# EAGLE design MethaneFlux (EAGLE 9.6.2)
Assembly variants: v1.0

## Sheet 1 of 2: Board 1- Power Module, Arduino MRK NB 1500, Methane Sensors (2600 2602 2611)
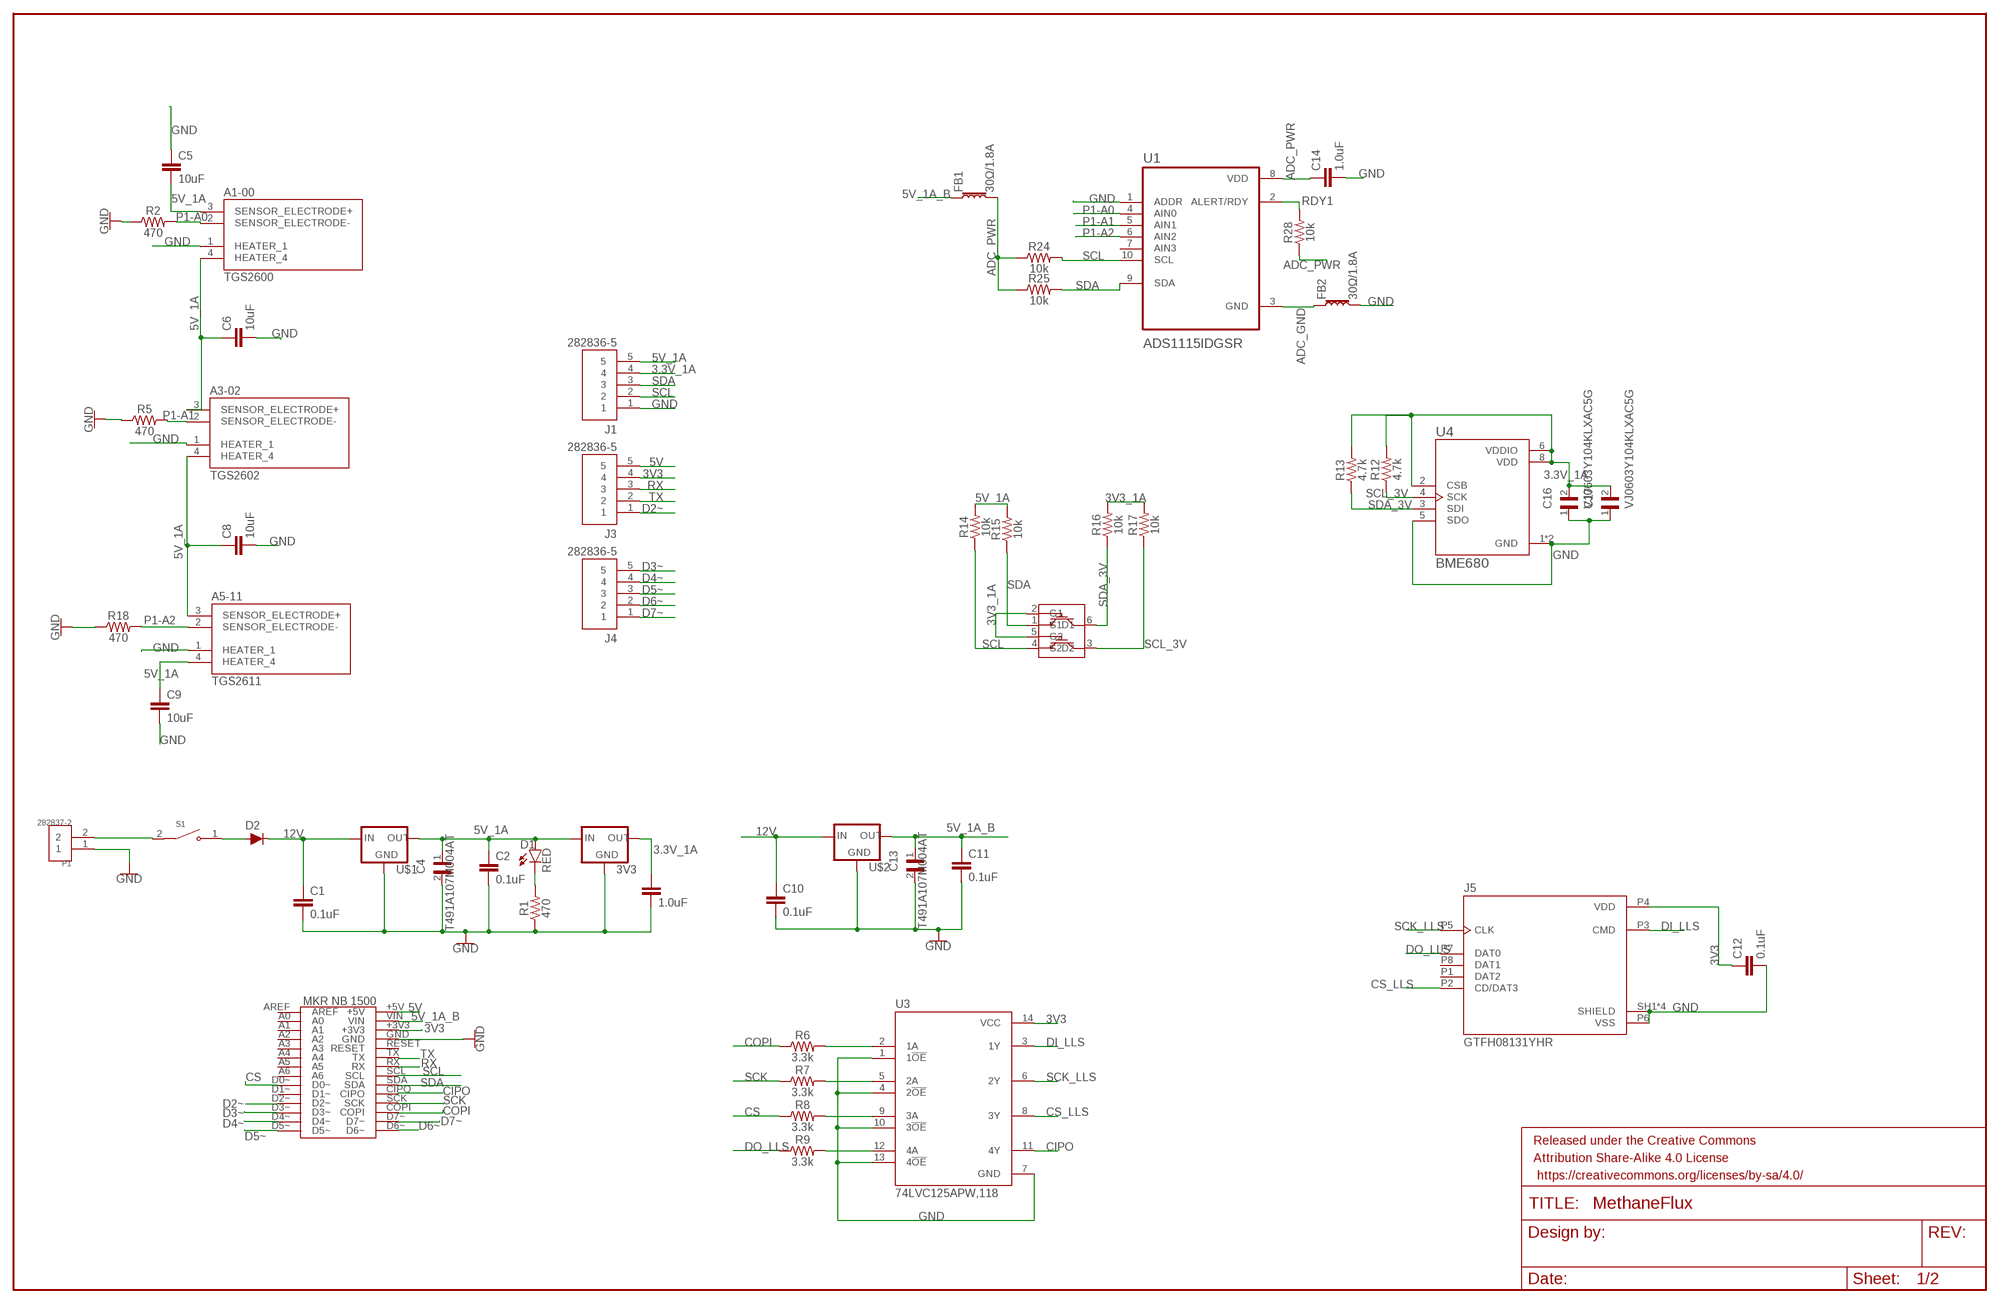
[diagram p0: schematic, sheet 1]

### Parts
3V3  V_REG_LD1117VXXLD1117-SMD  [SOT223]
A1-00  TGS2600  [TO255P920H830-4]
A3-02  TGS2602  [TGS2602]
A5-11  TGS2611  [TGS2611]
C1  0.1uF  0.1UF-0603-25V-5%  [0603]
C2  0.1uF  0.1UF-0603-25V-5%  [0603]
C3  1.0uF  1.0UF-0603-16V-10%  [0603]
C4  T491A107M004AT  [CAPC3216X110N]
C5  10uF  10UF-0603-6.3V-20%  [0603]
C6  10uF  10UF-0603-6.3V-20%  [0603]
C8  10uF  10UF-0603-6.3V-20%  [0603]
C9  10uF  10UF-0603-6.3V-20%  [0603]
C10  0.1uF  0.1UF-0603-25V-5%  [0603]
C11  0.1uF  0.1UF-0603-25V-5%  [0603]
C12  0.1uF  0.1UF-0603-25V-5%  [0603]
C13  T491A107M004AT  [CAPC3216X110N]
C14  1.0uF  1.0UF-0603-16V-10%  [0603]
C16  VJ0603Y104KLXAC5G  [CAPC1608X92N]
C17  VJ0603Y104KLXAC5G  [CAPC1608X92N]
D1  RED  LED-RED0603  [LED-0603]
D2  200mA/100V/1V  DIODE-1N4148  [DIODE-1N4148]
FB1  30Ω/1.8A  FERRITE_BEAD-0603  [0603]
FB2  30Ω/1.8A  FERRITE_BEAD-0603  [0603]
FRAME1  FRAME-LEDGER  [CREATIVE_COMMONS]
J1  282836-5  [TE_282836-5]
J3  282836-5  [TE_282836-5]
J4  282836-5  [TE_282836-5]
J5  GTFH08131YHR  [AMPHENOL_GTFH08131YHR]
P1  282837-2  [TE_282837-2]
R1  470  470OHM-0603-1/10W-1%  [0603]
R2  470  470OHM-0603-1/10W-1%  [0603]
R5  470  470OHM-0603-1/10W-1%  [0603]
R6  3.3k  3.3KOHM-0603-1/10W-1%  [0603]
R7  3.3k  3.3KOHM-0603-1/10W-1%  [0603]
R8  3.3k  3.3KOHM-0603-1/10W-1%  [0603]
R9  3.3k  3.3KOHM-0603-1/10W-1%  [0603]
R12  4.7k  4.7KOHM-0603-1/10W-1%  [0603]
R13  4.7k  4.7KOHM-0603-1/10W-1%  [0603]
R14  10k  10KOHM-0603-1/10W-1%  [0603]
R15  10k  10KOHM-0603-1/10W-1%  [0603]
R16  10k  10KOHM-0603-1/10W-1%  [0603]
R17  10k  10KOHM-0603-1/10W-1%  [0603]
R18  470  470OHM-0603-1/10W-1%  [0603]
R24  10k  10KOHM-0603-1/10W-1%  [0603]
R25  10k  10KOHM-0603-1/10W-1%  [0603]
R28  10k  10KOHM-0603-1/10W-1%  [0603]
S1  RB141C1100  [SW_RB141C1100]
U1  ADS1115IDGSR  [SOP50P490X110-10N]
U3  74LVC125APW,118  [IC_74LVC125APW,118]
U4  BME680  [PSON80P300X300X100-8N]
U$1  V_REG_LD1117VXXLD1117-SMD  [SOT223]
U$2  V_REG_LD1117VXXLD1117-SMD  [SOT223]
U$3  2N7002DW  [SOT363]
U$5  MKRNB1500  [MRKNB1500]

### Nets
3.3V_1A [5$3v3_1A]: 3V3.2(OUT) C3.1 C16.2 C17.2 J1.4 R12.2 R13.2 U4.2(CSB) U4.6(VDDIO) U4.8(VDD)
3V3: C12.1 J3.4 J5.P4(VDD) U3.14(VCC) U$5.+3V3
3V3_1A: R16.2 R17.2 U$3.2(G1) U$3.5(G2)
5V: J3.5 U$5.+5V
5V_1A [5$3v3_1A]: 3V3.3(IN) A1-00.3(SENSOR_ELECTRODE+) A1-00.4(HEATER_4) A3-02.3(SENSOR_ELECTRODE+) A3-02.4(HEATER_4) A5-11.3(SENSOR_ELECTRODE+) A5-11.4(HEATER_4) C2.1 C4.1 C5.2 C6.1 C8.1 C9.1 D1.A J1.5 R14.2 R15.2 U$1.2(OUT)
5V_1A_B [5$3v3_1A]: C11.1 C13.1 FB1.1 U$2.2(OUT) U$5.VIN
12V [PowerIn]: C1.1 C10.1 D2.C U$1.3(IN) U$2.3(IN)
ADC_GND: FB2.1 U1.3(GND)
ADC_PWR: C14.1 FB1.2 R24.1 R25.1 R28.1 U1.8(VDD)
CIPO: U3.11(4Y) U$5.CIPO
COPI: R6.1 U$5.COPI
CS: R8.1 U$5.D0~
CS_LLS: J5.P2(CD/DAT3) U3.8(3Y)
D2~: J3.1 U$5.D2~
D3~: J4.5 U$5.D3~
D4~: J4.4 U$5.D4~
D5~: J4.3 U$5.D5~
D6~: J4.2 U$5.D6~
D7~: J4.1 U$5.D7~
DI_LLS: J5.P3(CMD) U3.3(1Y)
DO_LLS: J5.P7(DAT0) R9.1
GND [GND]: 3V3.1(GND) A1-00.1(HEATER_1) A3-02.1(HEATER_1) A5-11.1(HEATER_1) C1.2 C2.2 C3.2 C4.2 C5.1 C6.2 C8.2 C9.2 C10.2 C11.2 C12.2 C13.2 C14.2 C16.1 C17.1 FB2.2 J1.1 J5.P6(VSS) J5.SH1(SHIELD) J5.SH2(SHIELD) J5.SH3(SHIELD) J5.SH4(SHIELD) P1.1 R1.1 R2.1 R5.1 R18.1 U1.1(ADDR) U3.1(1!OE) U3.4(2!OE) U3.7(GND) U3.10(3!OE) U3.13(4!OE) U4.1(GND) U4.5(SDO) U4.7(GND) U$1.1(GND) U$2.1(GND) U$5.GND
N$1: R6.2 U3.2(1A)
N$2 [5$3v3_1A]: D1.C R1.2
N$3: R7.2 U3.5(2A)
N$4 [PowerIn]: P1.2 S1.2
N$5: D2.A S1.1
N$6: R8.2 U3.9(3A)
N$7: R9.2 U3.12(4A)
P1-A0 [ADC]: A1-00.2(SENSOR_ELECTRODE-) R2.2 U1.4(AIN0)
P1-A1 [ADC]: A3-02.2(SENSOR_ELECTRODE-) R5.2 U1.5(AIN1)
P1-A2 [ADC]: A5-11.2(SENSOR_ELECTRODE-) R18.2 U1.6(AIN2)
RDY1: R28.2 U1.2(ALERT/RDY)
RX: J3.3 U$5.RX
SCK: R7.1 U$5.SCK
SCK_LLS: J5.P5(CLK) U3.6(2Y)
SCL: J1.2 R14.1 R24.2 U1.10(SCL) U$3.4(S2) U$5.SCL
SCL_3V: R12.1 R17.1 U4.4(SCK) U$3.3(D2)
SDA: J1.3 R15.1 R25.2 U1.9(SDA) U$3.1(S1) U$5.SDA
SDA_3V: R13.1 R16.1 U4.3(SDI) U$3.6(D1)
TX: J3.2 U$5.TX
Unconnected: J5.P1(DAT2) J5.P8(DAT1) U1.7(AIN3) U$5.A0 U$5.A1 U$5.A2 U$5.A3 U$5.A4 U$5.A5 U$5.A6 U$5.AREF U$5.D1~ U$5.RESET

## Sheet 2 of 2: Breakoff part to board 1- Methane Sensors (2600 2602 2611) and the ADC & BME
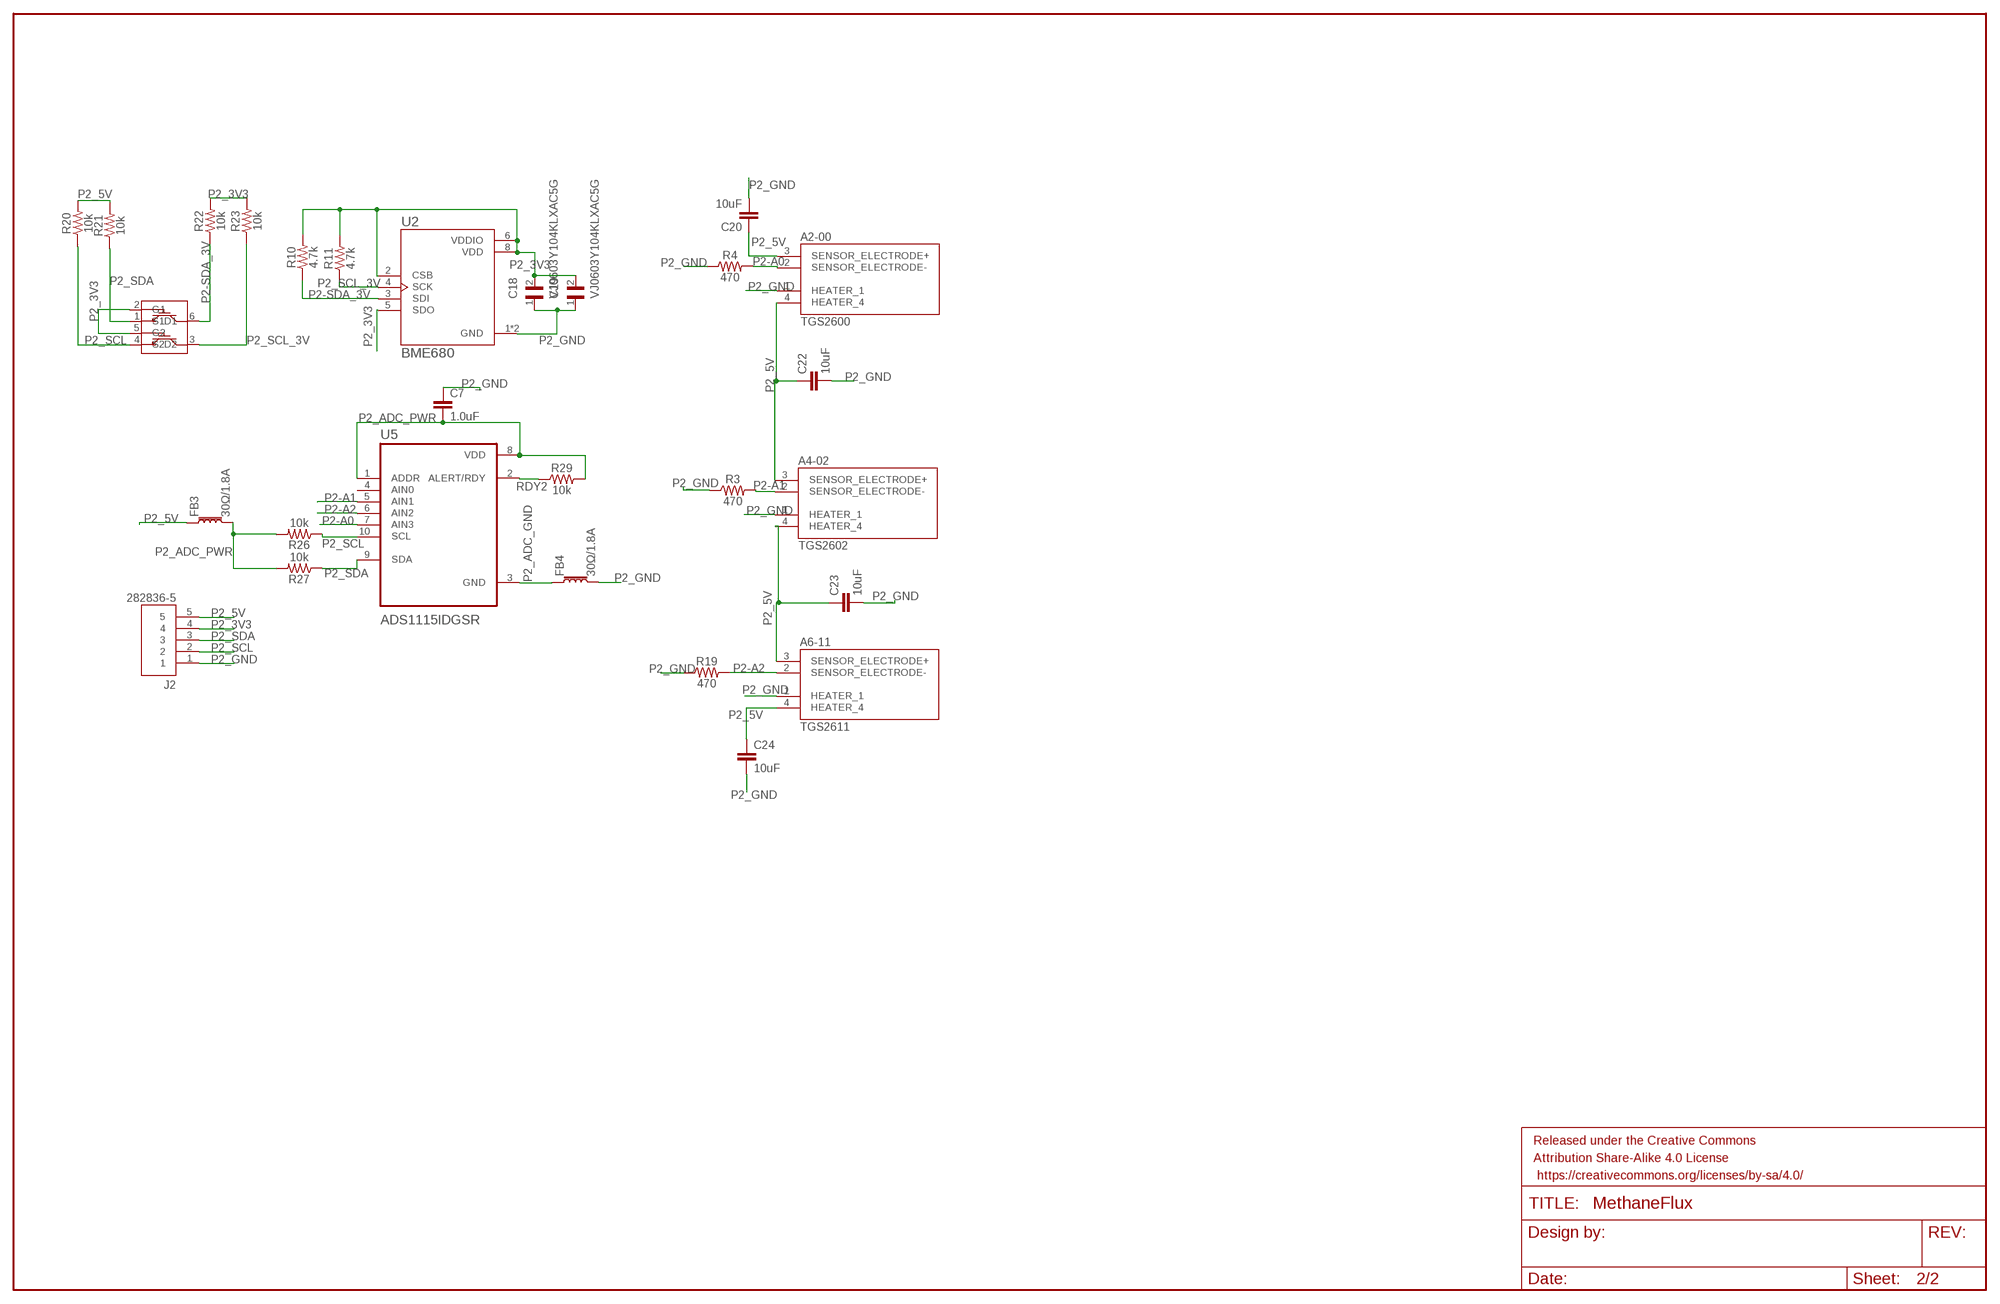
[diagram p1: schematic, sheet 2]

### Parts
A2-00  TGS2600  [TO255P920H830-4]
A4-02  TGS2602  [TGS2602]
A6-11  TGS2611  [TGS2611]
C7  1.0uF  1.0UF-0603-16V-10%  [0603]
C18  VJ0603Y104KLXAC5G  [CAPC1608X92N]
C19  VJ0603Y104KLXAC5G  [CAPC1608X92N]
C20  10uF  10UF-0603-6.3V-20%  [0603]
C22  10uF  10UF-0603-6.3V-20%  [0603]
C23  10uF  10UF-0603-6.3V-20%  [0603]
C24  10uF  10UF-0603-6.3V-20%  [0603]
FB3  30Ω/1.8A  FERRITE_BEAD-0603  [0603]
FB4  30Ω/1.8A  FERRITE_BEAD-0603  [0603]
FRAME2  FRAME-LEDGER  [CREATIVE_COMMONS]
J2  282836-5  [TE_282836-5]
R3  470  470OHM-0603-1/10W-1%  [0603]
R4  470  470OHM-0603-1/10W-1%  [0603]
R10  4.7k  4.7KOHM-0603-1/10W-1%  [0603]
R11  4.7k  4.7KOHM-0603-1/10W-1%  [0603]
R19  470  470OHM-0603-1/10W-1%  [0603]
R20  10k  10KOHM-0603-1/10W-1%  [0603]
R21  10k  10KOHM-0603-1/10W-1%  [0603]
R22  10k  10KOHM-0603-1/10W-1%  [0603]
R23  10k  10KOHM-0603-1/10W-1%  [0603]
R26  10k  10KOHM-0603-1/10W-1%  [0603]
R27  10k  10KOHM-0603-1/10W-1%  [0603]
R29  10k  10KOHM-0603-1/10W-1%  [0603]
U2  BME680  [PSON80P300X300X100-8N]
U5  ADS1115IDGSR  [SOP50P490X110-10N]
U$4  2N7002DW  [SOT363]

### Nets
P2-A0 [ADC]: A2-00.2(SENSOR_ELECTRODE-) R4.2 U5.7(AIN3)
P2-A1 [ADC]: A4-02.2(SENSOR_ELECTRODE-) R3.2 U5.5(AIN1)
P2-A2 [ADC]: A6-11.2(SENSOR_ELECTRODE-) R19.2 U5.6(AIN2)
P2-SDA_3V: R10.1 R22.1 U2.3(SDI) U$4.6(D1)
P2_3V3 [5$3v3_1A]: C18.2 C19.2 J2.4 R10.2 R11.2 R22.2 R23.2 U2.2(CSB) U2.5(SDO) U2.6(VDDIO) U2.8(VDD) U$4.2(G1) U$4.5(G2)
P2_5V [5$3v3_1A]: A2-00.3(SENSOR_ELECTRODE+) A2-00.4(HEATER_4) A4-02.3(SENSOR_ELECTRODE+) A4-02.4(HEATER_4) A6-11.3(SENSOR_ELECTRODE+) A6-11.4(HEATER_4) C20.1 C22.1 C23.1 C24.1 FB3.1 J2.5 R20.2 R21.2
P2_ADC_GND: FB4.1 U5.3(GND)
P2_ADC_PWR: C7.2 FB3.2 R26.2 R27.2 R29.2 U5.1(ADDR) U5.8(VDD)
P2_GND [P2_GND]: A2-00.1(HEATER_1) A4-02.1(HEATER_1) A6-11.1(HEATER_1) C7.1 C18.1 C19.1 C20.2 C22.2 C23.2 C24.2 FB4.2 J2.1 R3.1 R4.1 R19.1 U2.1(GND) U2.7(GND)
P2_SCL: J2.2 R20.1 R26.1 U5.10(SCL) U$4.4(S2)
P2_SCL_3V: R11.1 R23.1 U2.4(SCK) U$4.3(D2)
P2_SDA: J2.3 R21.1 R27.1 U5.9(SDA) U$4.1(S1)
RDY2: R29.1 U5.2(ALERT/RDY)
Unconnected: U5.4(AIN0)

## Library data of the parts
3V3 U$1 U$2 = SparkFun-IC-Power:V_REG_LD1117VXX: LD1117VXX voltage regulator. We carry the 3.3V version (COM-00526) in TO-220 package.; PROD_ID: VREG-13917
A1-00 A2-00 = TGS2600:TGS2600: Check availability <https://pricing.snapeda.com/parts/TGS2600/Figaro/view-part?ref=eda>; AVAILABILITY: In Stock; CHECK_PRICES: https://www.snapeda.com/parts/TGS2600/Figaro/view-part/?ref=eda; DESCRIPTION: Gas sensor [Figaro] TGS2600 Gas sensor; MF: Figaro; MP: TGS2600; PACKAGE: None; PRICE: None; SNAPEDA_LINK: https://www.snapeda.com/parts/TGS2600/Figaro/view-part/?ref=snap
A3-02 A4-02 = TGS2600:TGS2602
A5-11 A6-11 = TGS2600:TGS2611
C1 C2 C10-C12 = SparkFun-Capacitors:0.1UF: 0.1µF ceramic capacitors A capacitor is a passive two-terminal electrical component used to store electrical energy temporarily in an electric field.; PROD_ID: CAP-08604
C3 C7 C14 = SparkFun-Capacitors:1.0UF: 1µF ceramic capacitors A capacitor is a passive two-terminal electrical component used to store electrical energy temporarily in an electric field.; PROD_ID: CAP-00868
C4 C13 = T491A107M004AT:T491A107M004AT: Tantalum Capacitor; Capacitor Type:Solid; Capacitance:100µF; Capacitance Tolerance:± 20%; Voltage Rating:4VDC; Capacitor Dielectric Type:Tantalum; Package/Case:3216-18; Termination Type:SMD; ESR:4ohm; Leaded Process Compatible:Yes ;RoHS Compliant: Yes Check availability <https://pricing.snapeda.com/parts/T491A107M004AT/KEMET/view-part?ref=eda>; AVAILABILITY: In Stock; CHECK_PRICES: https://www.snapeda.com/parts/T491A107M004AT/KEMET/view-part/?ref=eda; DESCRIPTION: Capacitors Tantalum PCB 100uF SMD Tol 20% 4 VDC Case Size 3216 T491 Series | KEMET T491A107M004AT; MF: KEMET; MP: T491A107M004AT; PACKAGE: SMD-2 KEMET; PRICE: None; PURCHASE-URL: https://www.snapeda.com/api/url_track_click_mouser/?unipart_id=577514&manufacturer=KEMET&part_name=T491A107M004AT&search_term=t491a107m004at; SNAPEDA_LINK: https://www.snapeda.com/parts/T491A107M004AT/KEMET/view-part/?ref=snap
C5 C6 C8 C9 C20 C22-C24 = SparkFun-Capacitors:10UF: 10.0µF ceramic capacitors A capacitor is a passive two-terminal electrical component used to store electrical energy temporarily in an electric field.; PROD_ID: CAP-11015
C16-C19 = VJ0603Y104KLXAC5G:VJ0603Y104KLXAC5G: Multilayer Ceramic Capacitors MLCC - SMD/SMT 100nF 25volts 10% Check availability <https://pricing.snapeda.com/parts/VJ0603Y104KLXAC5G/Vishay/view-part?ref=eda>; AVAILABILITY: In Stock; CHECK_PRICES: https://www.snapeda.com/parts/VJ0603Y104KLXAC5G/Vishay/view-part/?ref=eda; DESCRIPTION: Multilayer Ceramic Capacitors MLCC - SMD/SMT 100nF 25volts 10%; MF: Vishay; MP: VJ0603Y104KLXAC5G; PACKAGE: 0603 Vishay; PRICE: None; SNAPEDA_LINK: https://www.snapeda.com/parts/VJ0603Y104KLXAC5G/Vishay/view-part/?ref=snap
D1 = SparkFun-LED:LED-RED: Red SMD LED Used in manufacturing of most products at SparkFun Packages: 0603 - SMD 0603 package [Product Link] <http://docs.avagotech.com/docs/AV02-0551EN> 0603 SMART - SMD 0603 SMART package ( more efficient and expensive)[Product Link] <http://www.osram-os.com/Graphics/XPic2/00077099_0.pdf> 1206 - SMD1206 package [Product Link] <https://www.sparkfun.com/datasheets/DevTools/LilyPad/Q150OVS4.pdff> SparkFun Products: Pro Mini 328 -5V <https://www.sparkfun.com/products/821> RedBoard <https://www.sparkfun.com/products/12757> IOIO-OTG <https://www.sparkfun.com/products/13613>; PROD_ID: DIO-00819
D2 = SparkFun-DiscreteSemi:DIODE: Diode These are standard reverse protection diodes and small signal diodes. SparkFun Products: SparkFun SparkPunk Sound Kit <https://www.sparkfun.com/products/11177> SparkFun ESP8266 Thing <https://www.sparkfun.com/products/13231>; PROD_ID: DIO-08378
FB1-FB4 = SparkFun-Coils:FERRITE_BEAD: Ferrite Bead (blocks, cores, rings, chokes, etc.) Inductor with layers of ferrite used to suppress high frequencies. Often used to isolate high frequency noise. SparkFun Products: IOIO-OTG - V2.2 <https://www.sparkfun.com/products/13613> SparkFun SAMD21 Mini Breakout <https://www.sparkfun.com/products/13664> SparkFun 6 Degrees of Freedom Breakout - LSM6DS3 <https://www.sparkfun.com/products/13339> SparkFun SAMD21 Dev Breakout <https://www.sparkfun.com/products/13672>; PROD_ID: NDUC-13805
FRAME1 FRAME2 = SparkFun-Aesthetics:FRAME-LEDGER: Schematic Frame - Ledger Standard 11x14 US Ledger frame
J1-J4 = 282836-5:282836-5: Check availability <https://pricing.snapeda.com/parts/282836-5/TE%20Connectivity/view-part?ref=eda>; AVAILABILITY: In Stock; CHECK_PRICES: https://www.snapeda.com/parts/282836-5/TE+Connectivity+AMP+Connectors/view-part/?ref=eda; COMMENT: 282836-5; DESCRIPTION: 5 Position Wire to Board Terminal Block Horizontal with Board 0.197 (5.00mm) Through Hole; EU_ROHS_COMPLIANCE: Compliant with Exemptions; MF: TE Connectivity; MP: 282836-5; PACKAGE: None; PRICE: None; PURCHASE-URL: https://www.snapeda.com/api/url_track_click_mouser/?unipart_id=417471&manufacturer=TE Connectivity&part_name=282836-5&search_term=282836-5; SNAPEDA_LINK: https://www.snapeda.com/parts/282836-5/TE+Connectivity+AMP+Connectors/view-part/?ref=snap
J5 = GTFH08131YHR:GTFH08131YHR: Check availability <https://pricing.snapeda.com/parts/GTFH08131YHR/Amphenol%20ICC/view-part?ref=eda>; AVAILABILITY: In Stock; CHECK_PRICES: https://www.snapeda.com/parts/GTFH08131YHR/Amphenol+FCI/view-part/?ref=eda; DESCRIPTION: Micro SD and SD Card Sockets, Input Output Connectors, Micro SD Socket, 8 Position, Hinge Type Right Angle SMT, LCP Black; MF: Amphenol ICC; MP: GTFH08131YHR; PACKAGE: None; PRICE: None; PURCHASE-URL: https://www.snapeda.com/api/url_track_click_mouser/?unipart_id=3603870&manufacturer=Amphenol ICC&part_name=GTFH08131YHR&search_term=micro sd socket; SNAPEDA_LINK: https://www.snapeda.com/parts/GTFH08131YHR/Amphenol+FCI/view-part/?ref=snap
P1 = 282837-2:282837-2: TERM BLOCK 5.08MM 2POS SIDE ENTY Check availability <https://pricing.snapeda.com/parts/282837-2/TE%20Connectivity/view-part?ref=eda>; AVAILABILITY: In Stock; CHECK_PRICES: https://www.snapeda.com/parts/282837-2/TE+Connectivity+AMP+Connectors/view-part/?ref=eda; COMMENT: 282837-2; DESCRIPTION: Terminal Block Connector Wire Receptacle 2 5.08 mm 30-16 AWG Green 13.5 A 250 V | TE Connectivity 282837-2; MF: TE Connectivity; MP: 282837-2; PACKAGE: None; PRICE: None; PURCHASE-URL: https://www.snapeda.com/api/url_track_click_mouser/?unipart_id=2549980&manufacturer=TE Connectivity&part_name=282837-2&search_term=None; SNAPEDA_LINK: https://www.snapeda.com/parts/282837-2/TE+Connectivity+AMP+Connectors/view-part/?ref=snap
R1-R5 R18 R19 = SparkFun-Resistors:470OHM: 470Ω resistor A resistor is a passive two-terminal electrical component that implements electrical resistance as a circuit element. Resistors act to reduce current flow, and, at the same time, act to lower voltage levels within circuits. - Wikipedia; PROD_ID: RES-07869
R6-R9 = SparkFun-Resistors:3.3KOHM: 3.3kΩ resistor A resistor is a passive two-terminal electrical component that implements electrical resistance as a circuit element. Resistors act to reduce current flow, and, at the same time, act to lower voltage levels within circuits. - Wikipedia; PROD_ID: RES-07851
R10-R13 = SparkFun-Resistors:4.7KOHM: 4.7kΩ resistor A resistor is a passive two-terminal electrical component that implements electrical resistance as a circuit element. Resistors act to reduce current flow, and, at the same time, act to lower voltage levels within circuits. - Wikipedia; PROD_ID: RES-07857
R14-R17 R20-R29 = SparkFun-Resistors:10KOHM: 10kΩ resistor A resistor is a passive two-terminal electrical component that implements electrical resistance as a circuit element. Resistors act to reduce current flow, and, at the same time, act to lower voltage levels within circuits. - Wikipedia; PROD_ID: RES-00824
S1 = RB141C1100:RB141C1100: Swicth SPST RB141C1100 Check availability <https://pricing.snapeda.com/parts/RB141C1100/E-Switch/view-part?ref=eda>; AVAILABILITY: In Stock; CHECK_PRICES: https://www.snapeda.com/parts/RB141C1100/E-Switch/view-part/?ref=eda; DESCRIPTION: Rocker Switch, RB1 Series, SPST, ON-OFF, Non-Illum, Black, 15A, 125VAC, QC | E-Switch RB141C1100; MF: E-Switch; MP: RB141C1100; PACKAGE: None; PRICE: None; PURCHASE-URL: https://www.snapeda.com/api/url_track_click_mouser/?unipart_id=4449618&manufacturer=E-Switch&part_name=RB141C1100&search_term=rs-001g-a-bb-4; SNAPEDA_LINK: https://www.snapeda.com/parts/RB141C1100/E-Switch/view-part/?ref=snap
U1 U5 = ADS1115IDGSR:ADS1115IDGSR: Check availability <https://pricing.snapeda.com/parts/ADS1115IDGSR/Texas%20Instruments/view-part?ref=eda>; AVAILABILITY: In Stock; CHECK_PRICES: https://www.snapeda.com/parts/ADS1115IDGSR/Texas+Instruments/view-part/?ref=eda; DESCRIPTION: 16-bit, 860-SPS, 4-channel, delta-sigma ADC with PGA, oscillator, VREF, comparator and I2C; MF: Texas Instruments; MP: ADS1115IDGSR; PACKAGE: VSSOP-10 Texas Instruments; PRICE: None; PURCHASE-URL: https://www.snapeda.com/api/url_track_click_mouser/?unipart_id=45903&manufacturer=Texas Instruments&part_name=ADS1115IDGSR&search_term=ads1115idgsr; SNAPEDA_LINK: https://www.snapeda.com/parts/ADS1115IDGSR/Texas+Instruments/view-part/?ref=snap
U2 U4 = BME680:BME680: Integrated Environmental Unit Check availability <https://pricing.snapeda.com/parts/BME680/Bosch%20Sensortec/view-part?ref=eda>; AVAILABILITY: In Stock; CHECK_PRICES: https://www.snapeda.com/parts/BME680/Bosch+Sensortec/view-part/?ref=eda; DESCRIPTION: Gas, Humidity, Pressure, Temperature Sensor I²C, SPI Output; MF: Bosch Sensortec; MP: BME680; PACKAGE: LGA-8 Bosch Tools; PRICE: None; PURCHASE-URL: https://www.snapeda.com/api/url_track_click_mouser/?unipart_id=947201&manufacturer=Bosch Sensortec&part_name=BME680&search_term=bme680; SNAPEDA_LINK: https://www.snapeda.com/parts/BME680/Bosch+Sensortec/view-part/?ref=snap
U3 = 74LVC125APW_118:74LVC125APW,118: Check availability <https://pricing.snapeda.com/parts/74LVC125APW%2C118/Nexperia%20USA%20Inc./view-part?ref=eda> Check availability <https://pricing.snapeda.com/parts/74LVC125APW%2C118/Nexperia%20USA%20Inc./view-part?ref=eda> Check availability <https://pricing.snapeda.com/parts/74LVC125APW%2C118/Nexperia%20USA%20Inc./view-part?ref=eda>; AVAILABILITY: In Stock; CHECK_PRICES: https://www.snapeda.com/parts/74LVC125APW,118/Nexperia/view-part/?ref=eda; DESCRIPTION: Buffer, Non-Inverting 4 Element 1 Bit per Element 3-State Output 14-TSSOP; MF: Nexperia USA Inc.; MP: 74LVC125APW,118; PACKAGE: TSSOP14-14 Nexperia USA Inc.; PRICE: None; PURCHASE-URL: https://www.snapeda.com/api/url_track_click_mouser/?unipart_id=5248541&manufacturer=Nexperia USA Inc.&part_name=74LVC125APW,118&search_term=74lvc125apw; SNAPEDA_LINK: https://www.snapeda.com/parts/74LVC125APW,118/Nexperia/view-part/?ref=snap
U$3 U$4 = 2N7002DW:2N7002DW: Check availability <https://pricing.snapeda.com/parts/2N7002DW/onsemi/view-part?ref=eda>; AVAILABILITY: In Stock; CHECK_PRICES: https://www.snapeda.com/parts/2N7002DW/Onsemi/view-part/?ref=eda; DESCRIPTION: Mosfet Array 60V 115mA 200mW Surface Mount SC-88 (SC-70-6); MF: onsemi; MP: 2N7002DW; PACKAGE: SC-88-6 ON Semiconductor; PRICE: None; PURCHASE-URL: https://www.snapeda.com/api/url_track_click_mouser/?unipart_id=7265289&manufacturer=onsemi&part_name=2N7002DW&search_term=2n7002dw; SNAPEDA_LINK: https://www.snapeda.com/parts/2N7002DW/Onsemi/view-part/?ref=snap
U$5 = MKRNB1500:MKRNB1500: Double check before printing that this layout is right.

## Net classes
0 I2C: width 0.229 mm, clearance 0.003 mm
1 ADC: width 0.305 mm, clearance 0.1 mm
2 PowerIn: width 0.508 mm, clearance 0.003 mm
3 5$3v3_1A: width 0.076 mm, clearance 0.003 mm
5 GND: width 0.025 mm, clearance 0.003 mm
6 P2_GND: width 0.025 mm, clearance 0.003 mm

## Board
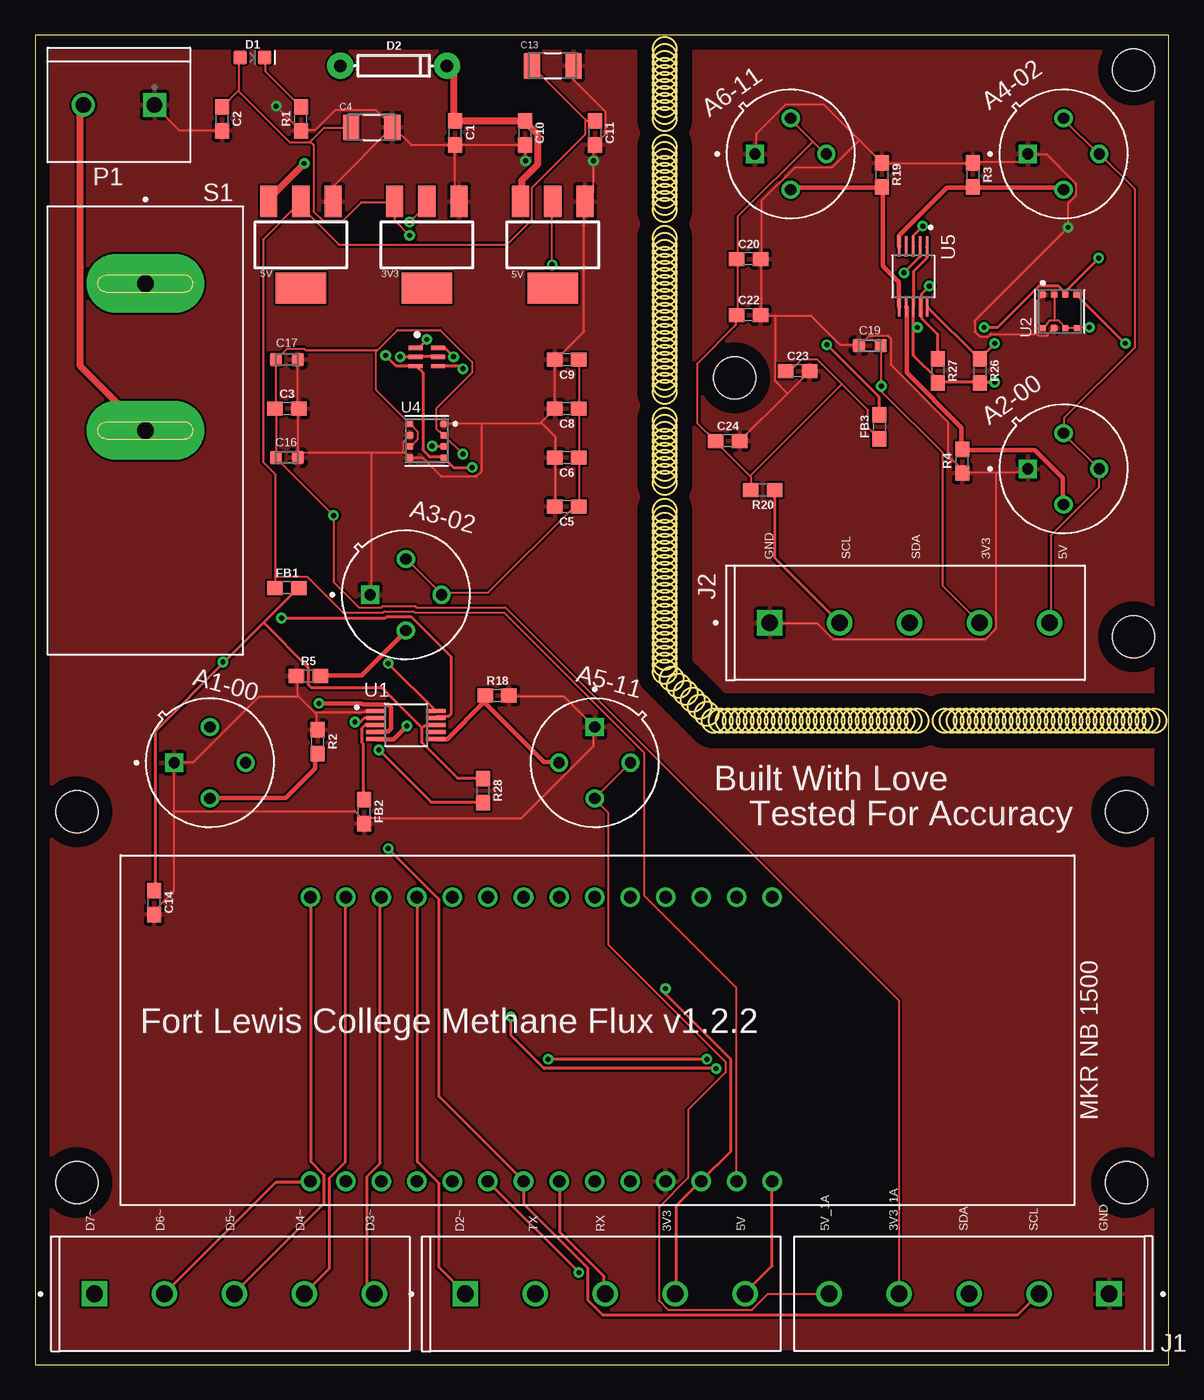
[diagram p2: board, top side]
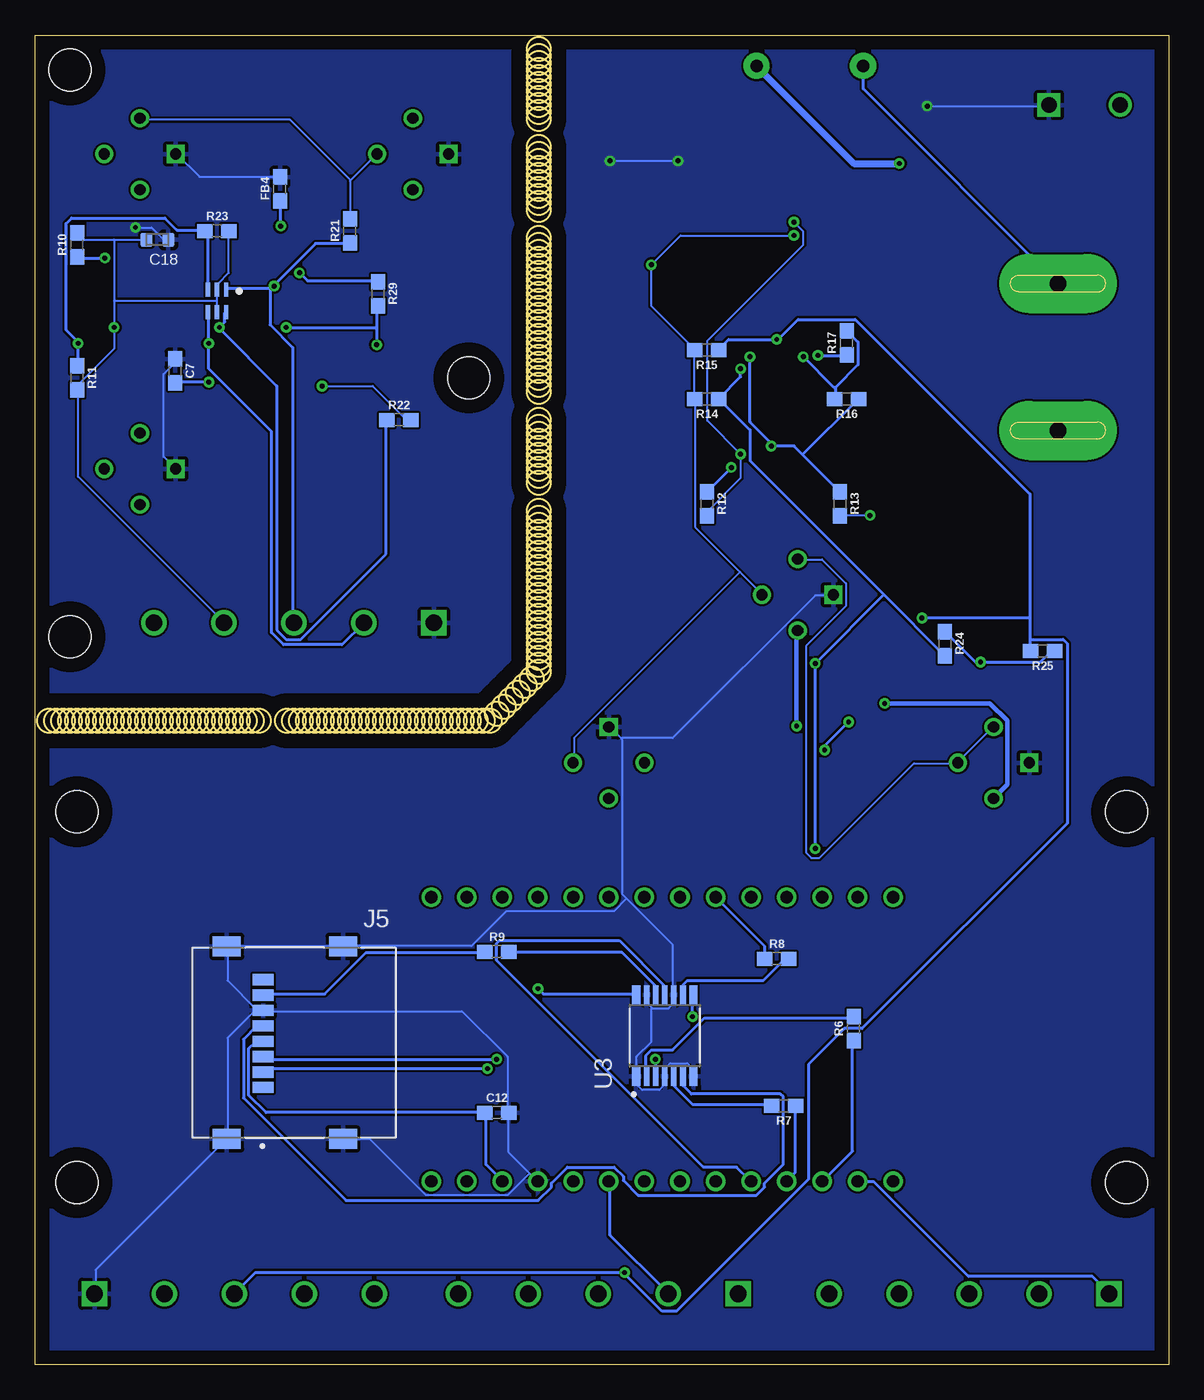
[diagram p3: board, bottom side, seen from below]

Size 81 x 95 mm. Coordinates in mm from the lower left corner, seen from the top.
Outline: 0,0 81,0 81,95 0,95 0,0
Outline: circle at 45,93.5 radius 0.85
Outline: circle at 45,93 radius 0.85
Outline: circle at 45,92.5 radius 0.85
Outline: circle at 45,92 radius 0.85
Outline: circle at 45,91.5 radius 0.85
Outline: circle at 45,91 radius 0.85
Outline: circle at 45,90.5 radius 0.85
Outline: circle at 45,90 radius 0.85
Outline: circle at 45,89.5 radius 0.85
Outline: circle at 45,87 radius 0.85
Outline: circle at 45,86.5 radius 0.85
Outline: circle at 45,86 radius 0.85
Outline: circle at 45,85.5 radius 0.85
Outline: circle at 45,85 radius 0.85
Outline: circle at 45,84.5 radius 0.85
Outline: circle at 45,84 radius 0.85
Outline: circle at 45,83.5 radius 0.85
Outline: circle at 45,83 radius 0.85
Outline: circle at 45,80.5 radius 0.85
Outline: circle at 45,80 radius 0.85
Copper layers (1*16): Top 0.035mm / dielectric 1.5mm / Bottom 0.035mm
Design rules "default *": minimum track width 6mil, minimum drill 0.35mm, track to track 6mil, track to pad 6mil, pad to pad 6mil, via to via 6mil, smd to smd 6mil, copper to edge 40mil, drill to drill 6mil, minimum pad ring 10mil, minimum via ring 8mil, stop-mask expansion 4mil, vias tented up to drill 0mil, thermal gap 10mil
Holes 3 mm at 78.5,52 50,70.5 78.5,92.5 78,39.5 78,13 3,13 3,39.5

### Footprints (pad centres in the part's own frame; a part is rotated, then mirrored left to right if it is on the bottom)
SOT223 = smd 1.219 x 2.235: 1 -2.311,-3.099; 2 0,-3.099; 3 2.311,-3.099 | smd 3.6 x 2.2: 4 0,3.099
TO255P920H830-4 = drill 0.8 square: 1 -2.55,0 | drill 0.8: 2 0,-2.55; 3 2.55,0; 4 0,2.55
TGS2602 = drill 0.8 square: 1 -2.55,0 | drill 0.8: 2 0,-2.55; 3 2.55,0; 4 0,2.55
TGS2611 = drill 0.8 square: 1 -2.55,0 | drill 0.8: 2 0,-2.55; 3 2.55,0; 4 0,2.55
0603 = smd 1.1 x 1: 1 -0.85,0; 2 0.85,0
CAPC3216X110N = smd 1.16 x 1.82: 1 -1.475,0; 2 1.475,0
CAPC1608X92N = smd 0.92 x 0.97: 1 -0.775,0; 2 0.775,0
LED-0603 = smd 1 x 1: A -0.877,0; C 0.877,0
DIODE-1N4148 = drill 0.9 pad 1.88: A -3.81,0; C 3.81,0
TE_282836-5 = drill 1.2 square: 1 -10,0 | drill 1.2: 2 -5,0; 3 0,0; 4 5,0; 5 10,0
AMPHENOL_GTFH08131YHR = smd 0.8 x 1.5: P1 3.2,-2.2; P2 2.1,-2.2; P3 1,-2.2; P4 -0.1,-2.2; P5 -1.2,-2.2; P6 -2.3,-2.2; P7 -3.4,-2.2; P8 -4.5,-2.2 | smd 1.45 x 2: SH1 -6.875,-4.8; SH2 6.875,-4.8; SH3 6.875,3.5; SH4 -6.875,3.5
TE_282837-2 = drill 1.1 square: 1 -2.54,0 | drill 1.1: 2 2.54,0
SW_RB141C1100 = drill 1.2 pad 4.2 long: 1 10.5,0; 2 0,0
SOP50P490X110-10N = smd 1.47 x 0.28: 1 -2.15,1; 2 -2.15,0.5; 3 -2.15,0; 4 -2.15,-0.5; 5 -2.15,-1; 6 2.15,-1; 7 2.15,-0.5; 8 2.15,0; 9 2.15,0.5; 10 2.15,1
PSON80P300X300X100-8N = smd 0.5 x 0.5: 1 1.2,1.2; 2 1.2,0.4; 3 1.2,-0.4; 4 1.2,-1.2; 5 -1.2,-1.22; 6 -1.2,-0.4; 7 -1.2,0.4; 8 -1.2,1.2
IC_74LVC125APW,118 = smd 1.35 x 0.6: 1 -2.925,2.05; 7 -2.925,-2.05; 8 2.925,-2.05; 14 2.925,2.05 | smd 1.35 x 0.4: 2 -2.925,1.3; 3 -2.925,0.65; 4 -2.925,0; 5 -2.925,-0.65; 6 -2.925,-1.3; 9 2.925,-1.3; 10 2.925,-0.65; 11 2.925,0; 12 2.925,0.65; 13 2.925,1.3
SOT363 = smd 0.3 x 0.99: 1 -0.65,-0.8; 2 0,-0.8; 3 0.65,-0.8; 4 0.65,0.81; 5 0,0.81; 6 -0.65,0.81
MRKNB1500 = drill 0.889: +3V3 5.08,20.3; +5V 0,20.3; A0 2.54,0; A1 5.08,0; A2 7.62,0; A3 10.16,0; A4 12.7,0; A5 15.24,0; A6 17.78,0; AREF 0,0; CIPO 22.86,20.3; COPI 27.94,20.3; D0~ 20.32,0; D1~ 22.86,0; D2~ 25.4,0; D3~ 27.94,0; D4~ 30.48,0; D5~ 33.02,0; D6~ 33.02,20.3; D7~ 30.48,20.3; GND 7.62,20.3; RESET 10.16,20.3; RX 15.24,20.3; SCK 25.4,20.3; SCL 17.78,20.3; SDA 20.32,20.3; TX 12.7,20.3; VIN 2.54,20.3

### Placement (x,y rotation side)
3V3  28,80 180 top
A1-00  12.5,43 0 top
A2-00  73.5,64 0 top
A3-02  26.5,55 0 top
A4-02  73.5,86.5 0 top
A5-11  40,43 270 top
A6-11  54,86.5 0 top
C1  30,88 270 top
C2  13.36,89 270 top
C3  18,68.3 0 top
C4  24.06,88.4 0 top
C5  38,61.3 0 top
C6  38,64.8 180 top
C7  71,71 270 bottom
C8  38,68.3 180 top
C9  38,71.8 180 top
C10  35,88 270 top
C11  40,88 270 top
C12  48,18 0 bottom
C13  37,92.8 0 top
C14  8.5,33 270 top
C16  18,64.8 180 top
C17  18,71.8 180 top
C18  72.25,80.37 180 bottom
C19  59.65,72.8 0 top
C20  51,79 0 top
C22  51,75 0 top
C23  54.5,71 0 top
C24  49.5,66 0 top
D1  15.54,93.39 0 top
D2  25.63,92.8 0 top
FB1  18,55.5 0 top
FB2  23.5,39.5 270 top
FB3  60.35,67 90 top
FB4  63.5,84 90 bottom
FRAME1  -77.51,34.96 0 top  (outside the outline)
FRAME2  -76.51,59.85 0 top  (outside the outline)
J1  66.75,5.05 180 top
J2  62.5,53 0 top
J3  40.75,5.05 0 top
J4  14.25,5.05 0 top
J5  62.5,23 270 bottom
P1  6,90 180 top
R1  19,89 90 top
R2  20.2,44.5 270 top
R3  67,85 270 top
R4  66.25,64.55 90 top
R5  19.54,49.2 0 top
R6  22.5,24 90 bottom
R7  27.5,18.5 180 bottom
R8  28,29 0 bottom
R9  48,29.5 0 bottom
R10  78,80 90 bottom
R11  78,70.5 270 bottom
R12  33,61.5 270 bottom
R13  23.5,61.5 270 bottom
R14  33,69 180 bottom
R15  33,72.5 180 bottom
R16  23,69 180 bottom
R17  23,73 90 bottom
R18  33.02,47.8 180 top
R19  60.5,85 270 top
R20  52,62.5 180 top
R21  58.5,81 90 bottom
R22  55,67.5 0 bottom
R23  68,81 0 bottom
R24  16,51.5 270 bottom
R25  9,51 180 bottom
R26  67.5,71 270 top
R27  64.5,71 270 top
R28  32,41 270 top
R29  56.5,76.5 270 bottom
S1  7.89,66.74 90 top
U1  26.5,45.7 0 top
U2  73.22,75.25 90 top
U3  36,23.5 90 bottom
U4  28,66 0 top
U5  62.75,77.75 270 top
U$1  37,80 180 top
U$2  19,80 180 top
U$3  28,72 270 top
U$4  68,76 180 bottom
U$5  52.69,33.39 180 top

### Tracks (layer width: path | path; a pad name or v marks a point on that pad's centre or on a via)
3.3V_1A  (via drill 0.35)
  Top 0.152: U4.6 26.86,65.63 27.34,66.1 27.34,66.67 26.86,67.15 U4.8 26.77,67.25 24.38,69.63 24.38,72.39 24.43,72.44 | 24.43,72.44 25.91,73.91 28.96,73.91 31.24,71.63 31.24,70.87 28.67,68.29 28.67,66.86 28.86,66.67 28.96,66.67 29.15,66.48 U4.2 29.24,66.39 v30.57,65.06 | v26.77,81.63 27.91,82.77 27.91,83.06 3V3.2 | J1.4 61.72,5.14 61.72,26 33.62,54.1 27.24,54.1 27.15,54.2 24.86,54.2 24.77,54.1 23.15,54.1 21.34,55.91 v21.34,60.67 17.24,64.77 C16.2 17.24,64.86 17.24,68.29 C3.1 17.24,68.39 17.24,71.72 C17.2 17.24,71.82 18,72.58 19.24,72.58 19.34,72.48 24.38,72.48 24.43,72.44
  Bottom 0.152: R12.2 32.96,60.67 32.96,60.96 30.57,63.34 v30.57,65.06 32.96,67.44 32.96,73.15 26.1,80.01 26.1,80.96 v26.77,81.63 | v21.34,60.67 23.43,60.67 R13.2
3V3  (via drill 0.35)
  Top 0.229: v45.05,26.86 45.05,26.48 49.72,21.81 49.72,15.24 47.62,13.14 U$5.+3V3 47.53,13.05 45.81,11.34 45.81,5.14 J3.4
  Bottom 0.229: U$5.+3V3 47.62,13.14 48.77,14.29 48.77,17.91 C12.1 48.96,18 64.48,18 65.72,19.24 65.72,22.57 65.25,23.05 64.77,23.05 J5.P4 | v45.05,26.86 44.67,26.48 38.1,26.48 U3.14
3V3_1A  (via drill 0.35)
  Top 0.229: U$3.5 28.77,72.01 27.24,72.01 U$3.2 27.15,72.01 v26.1,72.01
  Bottom 0.229: 23.81,69.82 23.81,69.06 R16.2 | 23.81,69.82 22.19,71.44 22.19,73.06 22.95,73.82 R17.2 | v26.1,72.01 23.91,69.82 23.81,69.82
5V
  Top 0.229: U$5.+5V 52.67,13.05 52.67,7.05 50.77,5.14 J3.5
5V_1A  (via drill 0.35)
  Top 0.152: A5-11.4 42.48,42.96 40.01,40.48 A5-11.3 40.01,40.39 40.96,39.43 40.96,30 49.34,21.62 49.34,20.86 46.67,18.19 46.67,13.34 44.58,11.24 44.58,4.57 45.24,3.9 51.24,3.9 52.39,5.05 56.67,5.05 J1.5 | 14.53,91.01 13.43,89.92 C2.1 | 14.53,91.01 14.57,91.06 14.57,93.34 D1.A | 19.67,87.39 19.62,87.34 18.19,87.34 14.53,91.01 | 19.67,87.39 20.67,88.39 C4.1 | 19.67,87.39 19.91,87.15 19.91,82.39 20.57,81.72 22,81.72 23.34,83.06 25.62,83.06 3V3.3 25.72,83.06 25.72,81.72 v26.77,80.68 | v36.96,78.58 36.96,83.06 U$1.2 | C9.1 38.86,71.72 38.86,68.39 C8.1 38.86,68.29 38.86,64.86 C6.1 38.86,64.77 38.86,61.34 C5.2 38.77,61.25 38.48,61.25 32.38,55.15 29.05,55.15 A3-02.3 29.05,55.05 26.57,57.53 A3-02.4
  Bottom 0.152: A1-00.4 12.57,45.53 15.05,43.05 A1-00.3 15.14,42.96 18.19,42.96 24.96,36.2 25.53,36.2 25.91,36.58 25.91,51.34 23.05,54.2 23.05,55.82 24.77,57.53 26.48,57.53 A3-02.4 | 30.62,56.63 29.05,55.05 A3-02.3 | 30.62,56.63 33.81,59.82 33.81,68.96 R14.2 33.91,69.06 33.91,72.48 R15.2 33.91,72.58 36.96,75.63 v36.96,78.58 34.86,80.68 v26.77,80.68 | 30.62,56.63 42.48,44.77 42.48,43.05 A5-11.4
5V_1A_B
  Top 0.152: 39.39,88.92 35.53,92.77 C13.1 | 39.39,88.92 39.43,88.87 39.91,88.87 C11.1 | 17.14,56.29 17.14,63.63 16.29,64.48 16.29,80.39 18.95,83.06 U$2.2 18.86,82.87 21.72,80.01 33.72,80.01 35.53,81.82 35.53,84.11 39.34,87.92 39.34,88.87 39.39,88.92 | 17.14,56.29 17.14,55.53 FB1.1 | 17.14,56.29 19.43,56.29 22,53.72 24.86,53.72 24.96,53.82 27.05,53.82 27.15,53.72 33.53,53.72 43.53,43.72 43.53,33.53 50.1,26.96 50.1,13.14 U$5.VIN
12V  (via drill 0.35)
  Top 0.508: D2.C 29.53,92.77 29.91,92.39 29.91,88.87 C1.1 30.19,88.87 34.96,88.87 C10.1 35.15,88.68 35.91,87.92 35.91,85.72 34.77,84.58 34.77,83.15 U$1.3 | v19.24,85.82 16.76,83.34 16.76,83.15 U$2.3
  Bottom 0.508: v19.24,85.82 22.48,85.82 29.43,92.77 D2.C
ADC_GND
  Top 0.229: FB2.1 23.43,40.39 23.43,44.39 23.34,44.48 23.34,45.43 23.62,45.72 24.29,45.72 U1.3
ADC_PWR  (via drill 0.35)
  Top 0.229: 27.62,45.43 27.62,44.48 30.19,41.91 31.91,41.91 R28.1 | 27.62,45.43 27.81,45.62 28.57,45.62 U1.8 | 16.34,53.01 18.76,55.44 FB1.2 | 16.34,53.01 13.48,50.15 | 13.48,50.15 8.57,45.24 8.57,33.91 C14.1 | 16.34,53.01 19.53,49.82 19.53,48.58 19.72,48.39 24.77,48.39 27.62,45.53 27.62,45.43 | v13.43,50.2 13.48,50.15
  Bottom 0.229: R25.1 8.19,50.96 8.38,50.96 9.14,50.2 v13.43,50.2 13.81,50.2 15.91,52.29 R24.1
CIPO
  Bottom 0.229: U3.11 36.01,26.48 36.01,27.05 39.24,30.29 47.82,30.29 48.01,30.1 48.01,28.86 33.24,14.1 30.86,14.1 29.91,13.14 U$5.CIPO
COPI
  Bottom 0.229: R6.1 22.57,23.15 22.57,15.24 24.67,13.14 U$5.COPI
CS
  Bottom 0.229: R8.1 28.86,29.05 28.86,29.91 32.29,33.34 U$5.D0~
CS_LLS  (via drill 0.35)
  Top 0.229: v34,24.86 34,23.53 36.39,21.14 v48.67,21.14
  Bottom 0.229: v34,24.86 34,26.38 U3.8 | v48.67,21.14 64.48,21.14 64.67,20.95 J5.P2
D2~
  Top 0.229: U$5.D2~ 27.34,33.34 27.34,14.48 28.86,12.95 28.86,6.95 30.67,5.14 J3.1
D3~
  Top 0.229: U$5.D3~ 24.67,33.34 24.67,14.38 23.72,13.43 23.72,5.62 24.19,5.14 J4.5
D4~
  Top 0.229: U$5.D4~ 22.19,33.34 22.19,14.48 21.05,13.34 21.05,6.86 19.34,5.14 J4.4
D5~
  Top 0.229: U$5.D5~ 19.72,33.34 19.72,14.48 20.67,13.53 20.67,11.53 14.29,5.14 J4.3
D6~
  Top 0.229: U$5.D6~ 19.62,13.05 17.24,13.05 9.34,5.14 J4.2
D7~
  Bottom 0.229: U$5.D7~ 22.19,13.05 21.05,13.05 14.29,6.29 5.43,6.29 4.29,5.14 J4.1
DI_LLS  (via drill 0.35)
  Top 0.229: v48.01,21.81 v36.67,21.81
  Bottom 0.229: v36.67,21.81 36.67,20.67 U3.3 | v48.01,21.81 64.58,21.81 64.67,21.91 J5.P3
DO_LLS
  Bottom 0.229: R9.1 48.86,29.43 57.34,29.43 60.29,26.48 64.67,26.48 J5.P7
GND  (via drill 0.35)
  Top 0.152: R18.1 33.91,47.72 37.81,47.72 39.91,45.62 A5-11.1 39.91,45.53 39.91,44.2 34.77,39.05 23.43,39.05 FB2.2 23.43,38.67 23.43,38.96 22.81,39.58 22.77,39.53 9.91,39.53 | 23.62,46.67 24.29,46.67 U1.1 23.62,46.67 | 18.81,47.77 18.76,47.82 18.76,49.15 R5.1 | 9.91,39.53 9.91,42.96 A1-00.1 10,43.05 11.34,43.05 16,47.72 18.76,47.72 18.81,47.77 | 9.91,39.53 9.91,33.81 8.57,32.48 8.57,32.19 C14.2 | C1.2 30,87.06 30,83.44 30.29,83.15 3V3.1 | C1.2 34.96,87.15 C10.2 35.05,87.06 v35.05,86.01 | C2.2 13.34,88.2 10.29,88.2 8.57,89.92 P1.1 | C4.2 25.53,88.49 24.38,89.63 21.43,89.63 20,88.2 19.05,88.2 R1.1 18.95,88.2 v17.24,89.92 | C4.2 21.34,84.2 21.34,83.15 U$2.1 | C1.2 29.91,87.15 26.86,87.15 25.62,88.39 C4.2 | 26.34,65.2 26.29,65.25 26.29,65.91 26.77,66.39 U4.7 | 26.34,65.2 26.48,65.06 26.57,65.06 26.77,64.86 U4.5 26.86,64.77 27.72,64.77 29.05,63.44 31.53,63.44 31.91,63.82 31.91,67.25 | 18.76,65.15 18.76,68.29 C3.2 18.76,68.39 18.76,71.72 C17.1 | 18.76,65.15 18.76,64.86 C16.1 18.76,65.15 | 18.76,65.15 24,65.15 | 24,65.15 26.29,65.15 26.34,65.2 | 24,65.15 24,55.05 A3-02.1 | C13.2 38.48,92.77 38.48,91.82 40.77,89.53 40.77,87.92 C11.2 39.91,87.06 v39.91,86.01 39.91,83.72 39.34,83.15 U$1.1 39.24,83.06 39.24,73.82 37.24,71.82 C9.2 37.15,71.72 37.15,68.39 C8.2 36.15,67.29 | C5.1 37.15,61.34 37.15,64.77 C6.2 37.15,64.86 37.15,66.29 36.15,67.29 | 31.91,67.25 36.1,67.25 36.15,67.29 | 31.91,67.25 29.24,67.25 U4.1 | 18.81,47.77 20.05,46.53 | 20.05,46.53 20.1,46.48 20.1,45.43 R2.1 | 23.62,46.67 23.53,46.58 20.1,46.58 20.05,46.53
  Bottom 0.152: 45.67,13.67 45.15,13.14 U$5.GND | 45.67,13.67 47.15,15.14 47.15,17.91 C12.2 47.24,18 47.24,22 50.48,25.24 64.67,25.24 J5.P6 | 45.67,13.67 47.24,12.1 53.05,12.1 57.05,16.1 58.96,16.1 J5.SH3 | J5.P6 64.77,25.34 65.15,25.34 67.25,27.43 67.25,29.81 J5.SH1 67.25,29.91 59.05,29.91 J5.SH4 58.96,29.91 49.82,29.91 47.34,32.38 39.62,32.38 38.72,33.29 | J5.P6 65.25,25.34 67.25,23.34 67.25,16.19 J5.SH2 67.34,16.1 76.68,6.76 76.68,5.14 J1.1 | 36.91,25.48 37.24,25.81 37.24,26.38 U3.13 | 36.91,25.48 36.86,25.43 35.72,25.43 35.43,25.72 35.43,26.38 U3.10 35.43,26.48 35.43,30 38.72,33.29 | U3.7 34,20.67 34,21.14 34.38,21.53 35.62,21.53 35.91,21.24 35.91,20.67 U3.4 36.01,20 36.39,19.62 37.62,19.62 38.01,20 38.01,20.57 U3.1 38.01,20.67 38.01,22 36.96,23.05 36.96,25.43 36.91,25.48 | 38.72,33.29 39.05,33.62 39.05,44.67 39.1,44.72 | 39.1,44.72 39.91,45.53 A5-11.1 | v17.24,89.92 8.57,89.92 P1.1 | v39.91,86.01 v35.05,86.01 | 39.1,44.72 39.05,44.77 35.43,44.77 25.24,54.96 24,54.96 A3-02.1
  pour Top: 0,95 44,95 44,49 48,45 81,45 81,0 0,0
  pour Bottom: 0,95 44,95 44,49 48,45 81,45 81,0 0,0
N$1
  Bottom 0.229: R6.2 22.57,24.77 33.15,24.77 35.43,22.48 36.96,22.48 37.34,22.1 37.34,20.67 U3.2
N$2
  Top 0.152: D1.C 16.48,93.34 16.48,92.39 18.95,89.92 R1.2
N$3
  Bottom 0.229: R7.2 28.38,18.57 34,18.57 35.34,19.91 35.34,20.57 U3.5
N$4
  Top 0.508: P1.2 3.23,89.37 3.23,78.39 3.24,78.39 3.24,71.34 7.81,66.77 S1.2
N$5
  Bottom 0.229: D2.A 21.81,92.77 21.81,91.15 7.91,77.25 S1.1
N$6
  Bottom 0.229: R8.2 27.24,28.96 27.43,28.96 28.96,27.43 34.38,27.43 34.67,27.15 34.67,26.48 U3.9
N$7
  Bottom 0.229: R9.2 47.15,29.43 39.05,29.43 36.67,27.05 36.67,26.48 U3.12
P1-A0  (via drill 0.35)
  Top 0.305: U1.4 24.38,45.24 25.24,45.24 25.43,45.43 25.43,46.96 25.24,47.15 23.43,47.15 23.34,47.24 v20.29,47.24 | A1-00.2 12.57,40.48 17.91,40.48 20,42.58 20,43.53 20.08,43.53 R2.2
  Bottom 0.305: v20.29,47.24 12.76,47.24 11.53,46.01 11.53,41.43 12.48,40.48 A1-00.2
P1-A1  (via drill 0.35)
  Top 0.305: R5.2 20.48,49.24 23.34,49.24 26.48,52.39 A3-02.2 | v26.57,45.62 25.62,44.67 24.38,44.67 U1.5
  Bottom 0.305: v26.57,45.62 26.57,52.39 A3-02.2
P1-A2
  Top 0.305: 32.1,47.34 32.1,47.72 R18.2 | 32.1,47.34 29.43,44.67 28.67,44.67 U1.6 | 32.1,47.34 36.39,43.05 37.43,43.05 A5-11.2
P2-A0
  Top 0.305: A2-00.2 73.44,61.53 73.44,63.34 71.44,65.34 66.29,65.34 R4.2 66.2,65.53 66.2,66.96 62.29,70.87 62.29,75.53 U5.7
P2-A1
  Top 0.305: A4-02.2 73.44,84.01 73.34,84.11 67.06,84.11 R3.2 66.86,84.11 65.15,84.11 61.72,80.68 61.72,79.92 U5.5
P2-A2
  Top 0.305: A6-11.2 54.01,84.01 54.1,84.11 60.48,84.11 R19.2 60.58,84.01 60.58,78.49 61.72,77.34 61.72,75.63 U5.6
P2-SDA_3V  (via drill 0.35)
  Top 0.229: v76.01,79.06 73.63,76.68 73.63,76.49 U2.3 73.53,76.68 73.15,77.06 71.72,77.06 68.77,74.11 v67.82,74.11
  Bottom 0.229: v76.01,79.06 77.92,79.06 R10.1 | U$4.6 67.44,75.15 67.44,74.49 v67.82,74.11 67.82,74.01 63.72,69.91 63.72,52.48 63.06,51.82 62.01,51.82 55.91,57.91 55.91,67.44 R22.1
P2_3V3  (via drill 0.35)
  Top 0.152: 72.87,74.58 73.15,74.58 73.63,74.11 | 72.87,74.58 72.48,74.58 72.3,74.39 72.3,74.3 72.1,74.11 U2.8 | 72.87,74.58 72.87,76.39 U2.2 | 73.63,74.11 74.39,74.11 U2.5 74.49,74.11 v75.34,74.11 | 73.63,74.11 U2.6 | C19.2 60.48,72.77 v60.48,69.91 60.48,69.53 64.86,65.15 64.86,55.63 67.44,53.05 J2.4
  Bottom 0.152: 68.01,76.01 68.01,76.77 U$4.2 67.91,76.87 67.91,77.25 67.15,78.01 67.15,80.96 R23.2 | 68.01,76.01 68.01,75.25 U$4.5 | 75.34,80.39 77.53,80.39 77.92,80.77 R10.2 | 75.34,80.39 73.06,80.39 C18.2 | 75.34,80.39 75.34,76.01 | 75.34,76.01 v75.34,74.11 75.34,72.58 77.92,70.01 77.92,69.72 R11.2 77.92,69.63 77.92,63.44 67.53,53.05 J2.4 | 75.34,76.01 68.01,76.01 | v60.48,69.91 56.86,69.91 54.48,67.53 54.2,67.53 R22.2
P2_5V
  Top 0.152: 57.67,70.06 59.53,68.2 59.53,66.96 60.29,66.2 FB3.1 | 57.67,70.06 55.91,71.82 54.77,71.82 54.01,71.06 53.72,71.06 C23.1 | 51.1,63.48 48.67,65.91 C24.1 48.58,66.01 47.34,67.25 47.34,71.53 50.1,74.3 50.1,74.96 C22.1 50.2,75.06 50.2,78.96 C20.1 50.2,79.06 50.2,82.01 55.58,87.39 | 51.1,63.48 51.15,63.44 51.15,62.58 R20.2 | 51.1,63.48 57.67,70.06 | J2.5 72.58,53.05 72.58,59.24 76.01,62.67 76.01,63.91 A2-00.3 76.01,64.01 73.53,66.48 A2-00.4 73.53,66.58 73.53,67.63 78.58,72.68 78.58,84.01 76.11,86.49 A4-02.3 76.01,86.49 73.53,88.96 A4-02.4 | 55.58,87.39 56.48,86.49 A6-11.3 | 55.58,87.39 54.01,88.96 A6-11.4
  Bottom 0.152: 58.44,84.63 56.58,86.49 A6-11.3 | 58.44,84.63 58.48,84.58 58.48,81.92 R21.2 | 58.44,84.63 62.77,88.96 73.44,88.96 A4-02.4
P2_ADC_GND  (via drill 0.35)
  Top 0.229: v63.44,81.34 62.77,80.68 62.77,79.92 U5.3
  Bottom 0.229: v63.44,81.34 63.44,83.06 FB4.1
P2_ADC_PWR  (via drill 0.35)
  Top 0.229: v56.58,72.87 60.29,69.15 60.29,67.91 FB3.2 | U5.1 63.72,79.82 63.72,79.06 62.77,78.11 62.77,75.63 U5.8 62.77,75.53 62.77,74.11 | v68.58,70.2 67.53,70.2 R26.2 67.44,70.2 64.58,70.2 R27.2 64.58,70.29 62.77,72.1 62.77,74.11 | 62.77,74.11 v63.06,74.11
  Bottom 0.229: 56.58,74.11 56.58,75.63 R29.2 | 56.58,74.11 v56.58,72.87 | v68.58,70.2 70.96,70.2 C7.2 | v63.06,74.11 56.58,74.11
P2_GND  (via drill 0.35)
  Top 0.152: 68.67,63.72 70.67,63.72 70.87,63.91 A2-00.1 | 68.67,63.72 66.29,63.72 R4.1 66.2,63.72 66.2,64.01 65.25,64.96 65.25,67.34 61.15,71.44 61.15,73.34 60.96,73.53 59.63,73.53 58.96,72.87 C19.1 58.86,72.87 57.53,72.87 55.44,74.96 52.86,74.96 | 68.67,63.72 68.67,52.58 67.91,51.82 57.05,51.82 55.91,52.96 52.58,52.96 J2.1 | 53.77,69.39 55.34,70.96 C23.2 | 53.77,69.39 50.39,66.01 C24.2 | 52.86,74.96 51.91,74.96 C22.2 51.91,75.06 51.91,78.96 C20.2 51.91,79.06 51.91,83.15 54.29,85.53 56.96,85.53 58.91,87.49 | 53.77,69.39 52.86,70.29 52.86,74.96 | 58.91,87.49 60.48,85.92 R19.1 60.58,85.82 66.96,85.82 R3.1 67.06,85.92 70.29,85.92 70.87,86.49 A4-02.1 70.96,86.49 72.3,86.49 74.39,84.39 74.39,83.53 73.82,82.96 v73.82,81.25 67.15,74.58 67.15,73.82 67.53,73.44 68.1,73.44 68.29,73.63 71.53,73.63 71.58,73.68 | 58.91,87.49 56.39,90.01 53.63,90.01 51.53,87.92 51.53,86.58 A6-11.1 | 71.58,73.68 71.53,73.72 71.53,75.91 72.01,76.39 U2.1 | 71.58,73.68 71.72,73.53 72.3,73.53 72.77,74.01 U2.7
  Bottom 0.152: C7.1 71.06,71.82 71.06,71.53 71.82,70.77 71.82,64.86 A2-00.1 | v73.82,81.25 72.68,81.25 71.82,80.39 71.53,80.39 C18.1 | FB4.2 63.53,84.87 69.25,84.87 70.87,86.49 A4-02.1
  pour Top: 46,95 46,50 49,47 81,47 81,95
  pour Bottom: 46,95 81,95 81,47 49,47 46,50
P2_SCL  (via drill 0.35)
  Top 0.229: v68.58,72.96 67.53,71.91 R26.1 67.44,71.91 63.82,75.53 U5.10 | R20.1 52.86,62.48 52.86,57.63 57.44,53.05 J2.2
  Bottom 0.229: U$4.4 68.58,75.15 v68.58,72.96 68.58,71.15 64.1,66.67 64.1,52.29 63.25,51.44 59.05,51.44 57.53,52.96 J2.2
P2_SCL_3V  (via drill 0.35)
  Top 0.229: v77.92,72.96 74.49,76.39 U2.4
  Bottom 0.229: U$4.3 68.67,76.87 68.67,80.87 68.77,80.96 R23.1 68.87,81.06 70.87,81.06 71.72,81.92 78.39,81.92 78.77,81.53 78.77,73.91 77.92,73.06 v77.92,72.96 77.92,71.44 R11.1
P2_SDA  (via drill 0.35)
  Top 0.229: R27.1 64.48,71.91 64.48,73.63 63.34,74.77 63.34,75.53 U5.9 63.34,75.63 63.34,76.49 v63.91,77.06
  Bottom 0.229: 64.2,76.87 67.34,76.87 U$4.1 | 63.96,77.11 60.96,80.11 58.58,80.11 R21.1 | 63.96,77.11 64.2,76.87 | v63.91,77.06 63.96,77.11 | 64.2,76.87 64.2,74.3 62.58,72.68 62.58,53.05 J2.3
RDY1  (via drill 0.35)
  Top 0.229: v24.57,43.91 28.29,40.2 31.91,40.2 R28.2 | v22.86,45.91 23.24,45.91 23.53,46.2 24.29,46.2 U1.2
  Bottom 0.229: v24.57,43.91 24.57,44.2 v22.86,45.91
RDY2  (via drill 0.35)
  Top 0.229: v62.1,78.01 63.25,79.15 63.25,79.82 U5.2
  Bottom 0.229: v62.1,78.01 61.53,77.44 56.58,77.44 R29.1
RX
  Top 0.229: U$5.RX 37.53,13.05 37.53,9.43 40.67,6.29 40.67,5.14 J3.3
SCK
  Bottom 0.229: R7.1 26.67,18.48 26.67,13.72 27.24,13.14 U$5.SCK
SCK_LLS
  Bottom 0.229: U3.6 34.67,20.57 34.67,19.91 34.1,19.34 27.72,19.34 27.53,19.14 27.53,14.29 28.86,12.95 28.86,12.67 29.43,12.1 37.91,12.1 38.96,13.14 38.96,13.43 39.62,14.1 42.96,14.1 44.1,12.95 44.1,12.67 45.05,11.72 58.77,11.72 66.1,19.05 66.1,23.24 65.15,24.19 64.77,24.19 J5.P5
SCL  (via drill 0.35)
  Top 0.229: v30.57,71.15 30.39,71.34 28.86,71.34 U$3.4 | v25.24,50.1 28.57,46.77 U1.10 | J1.2 71.72,5.05 70.2,3.52 40.58,3.52 39.53,4.57 39.53,6.86 34.96,11.43 34.96,13.05 U$5.SCL 34.86,13.14 28.86,19.14 28.86,33.24 v25.24,36.86
  Bottom 0.229: v30.57,71.15 30.57,70.58 32.1,69.06 R14.1 32.1,68.96 29.91,66.77 29.91,64.58 20.34,55.01 | 20.34,55.01 16,50.67 R24.2 | 20.34,55.01 v25.24,50.1 v25.24,36.86
SCL_3V  (via drill 0.35)
  Top 0.229: v31.24,64.1 29.91,64.1 29.24,64.77 U4.4 29.15,64.86 28.19,64.86 27.72,65.34 27.72,70.87 27.24,71.34 U$3.3 27.15,71.34 25.81,71.34 v25.05,72.1
  Bottom 0.229: v31.24,64.1 32.96,62.39 R12.1 | v25.05,72.1 23.05,72.1 R17.1
SDA  (via drill 0.35)
  Top 0.229: v38.86,6.57 32.38,13.05 U$5.SDA | v28,73.25 27.43,72.68 27.24,72.68 U$3.1 | v17.62,53.34 25.05,53.34 25.15,53.44 26.86,53.44 29.72,50.58 29.72,46.48 29.53,46.29 28.67,46.29 U1.9
  Bottom 0.229: J1.3 66.67,5.14 65.25,6.57 v38.86,6.57 38.86,6.48 36.2,3.81 35.15,3.81 25.72,13.24 25.72,21.43 23.15,24 21.91,24 7.24,38.67 7.24,51.53 7.53,51.82 9.91,51.82 | R15.1 32.1,72.58 31.43,73.25 v28,73.25 27.91,73.25 26.48,74.68 22.38,74.68 9.91,62.2 9.91,53.34 | 9.91,53.34 9.91,51.82 | 9.91,51.82 9.91,51.05 R25.2 | 9.91,53.34 v17.62,53.34
SDA_3V  (via drill 0.35)
  Top 0.229: v28.38,65.63 29.15,65.63 U4.3 | v29.91,72.01 29.34,72.58 28.86,72.58 U$3.6
  Bottom 0.229: 26.15,65.01 23.53,62.39 R13.1 | 26.15,65.01 26.77,65.63 v28.38,65.63 28.29,65.72 29.91,67.34 v29.91,72.01 | 26.15,65.01 22.19,68.96 R16.1
TX
  Bottom 0.229: U$5.TX 39.91,13.05 39.91,9.24 35.81,5.14 J3.2

### Text on the board
tNames: 5V | 3V3 | 5V | GND | SCL | SDA | 3V3 | 5V | Built With Love | Tested For Accuracy | Fort Lewis College Methane Flux v1.2.2 | D7~ | D6~ | D5~ | D4~ | D3~ | D2~ | TX | RX | 3V3 | 5V | 5V_1A | 3V3_1A | SDA | SCL | GND